# Altium project Backplane_REVA.PrjPcb (part 1 of 3)
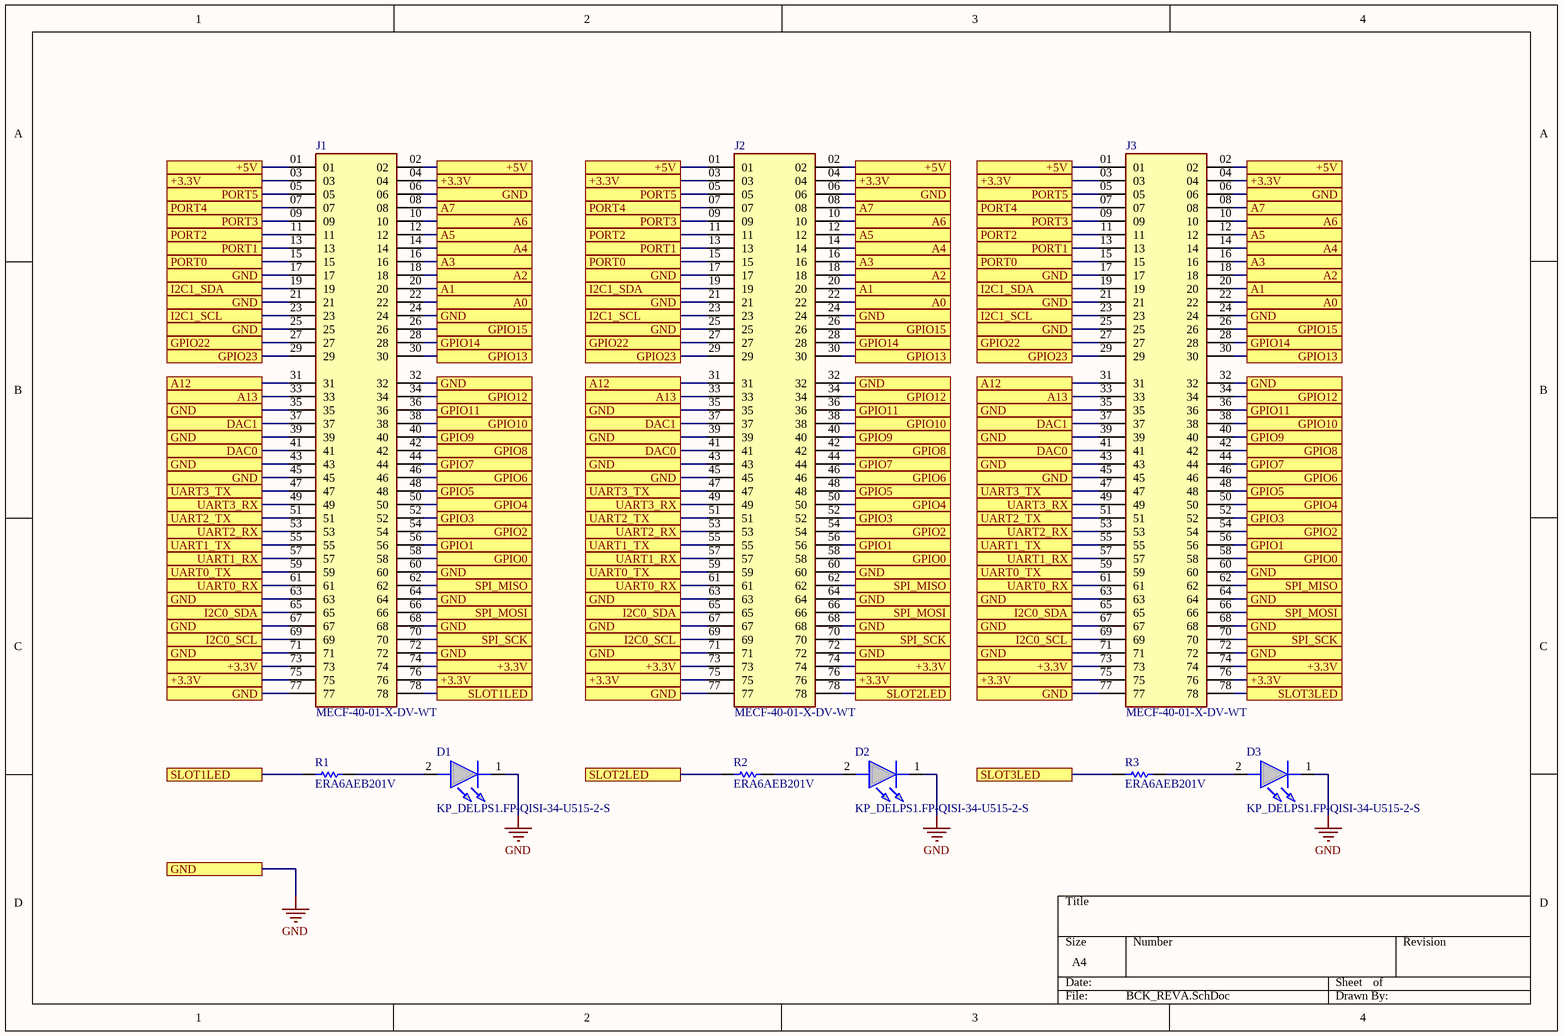
[diagram p0: BCK_REVA.SchDoc]
3 sheets, 27 parts. Net scope: flat (ports and power ports of the same name join across sheets).
Board file: BCK_REVA.PcbDoc
Sheets:
  BCK_REVA.SchDoc
  BCK_REVA_2.SchDoc
  BCK_REVA_3.SchDoc

## Sheet BCK_REVA.SchDoc
size A4; SheetNumber: 1; SheetTotal: 3

### Parts
D1  KP_DELPS1.FP-QISI-34-U515-2-S  [KPDELPS1FPQISI34U5152S]
D2  KP_DELPS1.FP-QISI-34-U515-2-S  [KPDELPS1FPQISI34U5152S]
D3  KP_DELPS1.FP-QISI-34-U515-2-S  [KPDELPS1FPQISI34U5152S]
J1  MECF-40-01-X-DV-WT  [SAMTEC_MECF-40-01-X-DV-WT]
J2  MECF-40-01-X-DV-WT  [SAMTEC_MECF-40-01-X-DV-WT]
J3  MECF-40-01-X-DV-WT  [SAMTEC_MECF-40-01-X-DV-WT]
R1  ERA6AEB201V  [RESC2013X60X40NL20T25]
R2  ERA6AEB201V  [RESC2013X60X40NL20T25]
R3  ERA6AEB201V  [RESC2013X60X40NL20T25]

### Ports
+3.3V (see BCK_REVA[1A], BCK_REVA[1C], BCK_REVA[2A], BCK_REVA[2C], BCK_REVA[3A], BCK_REVA[3C], BCK_REVA[4A], BCK_REVA[4C], BCK_REVA_2[1A], BCK_REVA_2[1C], BCK_REVA_2[2A], BCK_REVA_2[2C], BCK_REVA_2[3A], BCK_REVA_2[3C], BCK_REVA_2[4A], BCK_REVA_2[4C], BCK_REVA_3[1A], BCK_REVA_3[1C], BCK_REVA_3[2A], BCK_REVA_3[2C], BCK_REVA_3[3A], BCK_REVA_3[3C], BCK_REVA_3[4A], BCK_REVA_3[4C]), +3.3V (see BCK_REVA[1A], BCK_REVA[1C], BCK_REVA[2A], BCK_REVA[2C], BCK_REVA[3A], BCK_REVA[3C], BCK_REVA[4C], BCK_REVA_2[1A], BCK_REVA_2[1C], BCK_REVA_2[2A], BCK_REVA_2[2C], BCK_REVA_2[3A], BCK_REVA_2[3C], BCK_REVA_2[4A], BCK_REVA_2[4C], BCK_REVA_3[1A], BCK_REVA_3[1C], BCK_REVA_3[2A], BCK_REVA_3[2C], BCK_REVA_3[3A], BCK_REVA_3[3C], BCK_REVA_3[4A], BCK_REVA_3[4C]), +3.3V (see BCK_REVA[1C], BCK_REVA[2A], BCK_REVA[2C], BCK_REVA[3A], BCK_REVA[3C], BCK_REVA[4A], BCK_REVA[4C], BCK_REVA_2[1A], BCK_REVA_2[1C], BCK_REVA_2[2A], BCK_REVA_2[2C], BCK_REVA_2[3A], BCK_REVA_2[3C], BCK_REVA_2[4A], BCK_REVA_2[4C], BCK_REVA_3[1A], BCK_REVA_3[1C], BCK_REVA_3[2A], BCK_REVA_3[2C], BCK_REVA_3[3A], BCK_REVA_3[3C], BCK_REVA_3[4A], BCK_REVA_3[4C]), +5V (see BCK_REVA[1A], BCK_REVA[2A], BCK_REVA[3A], BCK_REVA[4A], BCK_REVA_2[1A], BCK_REVA_2[2A], BCK_REVA_2[3A], BCK_REVA_2[4A], BCK_REVA_3[1A], BCK_REVA_3[2A], BCK_REVA_3[3A], BCK_REVA_3[4A]), +5V (see BCK_REVA[1A], BCK_REVA[2A], BCK_REVA[3A], BCK_REVA_2[1A], BCK_REVA_2[2A], BCK_REVA_2[3A], BCK_REVA_2[4A], BCK_REVA_3[1A], BCK_REVA_3[2A], BCK_REVA_3[3A], BCK_REVA_3[4A]), +5V (see BCK_REVA[2A], BCK_REVA[3A], BCK_REVA[4A], BCK_REVA_2[1A], BCK_REVA_2[2A], BCK_REVA_2[3A], BCK_REVA_2[4A], BCK_REVA_3[1A], BCK_REVA_3[2A], BCK_REVA_3[3A], BCK_REVA_3[4A]), A0 (see BCK_REVA[2B], BCK_REVA[3B], BCK_REVA_2[2B], BCK_REVA_2[3B], BCK_REVA_2[4B], BCK_REVA_3[2B], BCK_REVA_3[3B], BCK_REVA_3[4B]), A0 (see BCK_REVA[2B], BCK_REVA[4B], BCK_REVA_2[2B], BCK_REVA_2[3B], BCK_REVA_2[4B], BCK_REVA_3[2B], BCK_REVA_3[3B], BCK_REVA_3[4B]), A0 (see BCK_REVA[3B], BCK_REVA[4B], BCK_REVA_2[2B], BCK_REVA_2[3B], BCK_REVA_2[4B], BCK_REVA_3[2B], BCK_REVA_3[3B], BCK_REVA_3[4B]), A1 (see BCK_REVA[2B], BCK_REVA[3B], BCK_REVA_2[2B], BCK_REVA_2[3B], BCK_REVA_2[4B], BCK_REVA_3[2B], BCK_REVA_3[3B], BCK_REVA_3[4B]), A1 (see BCK_REVA[2B], BCK_REVA[4B], BCK_REVA_2[2B], BCK_REVA_2[3B], BCK_REVA_2[4B], BCK_REVA_3[2B], BCK_REVA_3[3B], BCK_REVA_3[4B]), A1 (see BCK_REVA[3B], BCK_REVA[4B], BCK_REVA_2[2B], BCK_REVA_2[3B], BCK_REVA_2[4B], BCK_REVA_3[2B], BCK_REVA_3[3B], BCK_REVA_3[4B]), A2 (see BCK_REVA[2B], BCK_REVA[3B], BCK_REVA_2[2B], BCK_REVA_2[3B], BCK_REVA_2[4B], BCK_REVA_3[2B], BCK_REVA_3[3B], BCK_REVA_3[4B]), A2 (see BCK_REVA[2B], BCK_REVA[4B], BCK_REVA_2[2B], BCK_REVA_2[3B], BCK_REVA_2[4B], BCK_REVA_3[2B], BCK_REVA_3[3B], BCK_REVA_3[4B]), A2 (see BCK_REVA[3B], BCK_REVA[4B], BCK_REVA_2[2B], BCK_REVA_2[3B], BCK_REVA_2[4B], BCK_REVA_3[2B], BCK_REVA_3[3B], BCK_REVA_3[4B]), A3 (see BCK_REVA[2B], BCK_REVA[3B], BCK_REVA_2[2B], BCK_REVA_2[3B], BCK_REVA_2[4B], BCK_REVA_3[2B], BCK_REVA_3[3B], BCK_REVA_3[4B]), A3 (see BCK_REVA[2B], BCK_REVA[4B], BCK_REVA_2[2B], BCK_REVA_2[3B], BCK_REVA_2[4B], BCK_REVA_3[2B], BCK_REVA_3[3B], BCK_REVA_3[4B]), A3 (see BCK_REVA[3B], BCK_REVA[4B], BCK_REVA_2[2B], BCK_REVA_2[3B], BCK_REVA_2[4B], BCK_REVA_3[2B], BCK_REVA_3[3B], BCK_REVA_3[4B]), A4 (see BCK_REVA[2A], BCK_REVA[3A], BCK_REVA_2[2A], BCK_REVA_2[3A], BCK_REVA_2[4A], BCK_REVA_3[2A], BCK_REVA_3[3A], BCK_REVA_3[4A]), A4 (see BCK_REVA[2A], BCK_REVA[4A], BCK_REVA_2[2A], BCK_REVA_2[3A], BCK_REVA_2[4A], BCK_REVA_3[2A], BCK_REVA_3[3A], BCK_REVA_3[4A]), A4 (see BCK_REVA[3A], BCK_REVA[4A], BCK_REVA_2[2A], BCK_REVA_2[3A], BCK_REVA_2[4A], BCK_REVA_3[2A], BCK_REVA_3[3A], BCK_REVA_3[4A]), A5 (see BCK_REVA[2A], BCK_REVA[3A], BCK_REVA_2[2A], BCK_REVA_2[3A], BCK_REVA_2[4A], BCK_REVA_3[2A], BCK_REVA_3[3A], BCK_REVA_3[4A]), A5 (see BCK_REVA[2A], BCK_REVA[4A], BCK_REVA_2[2A], BCK_REVA_2[3A], BCK_REVA_2[4A], BCK_REVA_3[2A], BCK_REVA_3[3A], BCK_REVA_3[4A]), A5 (see BCK_REVA[3A], BCK_REVA[4A], BCK_REVA_2[2A], BCK_REVA_2[3A], BCK_REVA_2[4A], BCK_REVA_3[2A], BCK_REVA_3[3A], BCK_REVA_3[4A]), A6 (see BCK_REVA[2A], BCK_REVA[3A], BCK_REVA_2[2A], BCK_REVA_2[3A], BCK_REVA_2[4A], BCK_REVA_3[2A], BCK_REVA_3[3A], BCK_REVA_3[4A]), A6 (see BCK_REVA[2A], BCK_REVA[4A], BCK_REVA_2[2A], BCK_REVA_2[3A], BCK_REVA_2[4A], BCK_REVA_3[2A], BCK_REVA_3[3A], BCK_REVA_3[4A]), A6 (see BCK_REVA[3A], BCK_REVA[4A], BCK_REVA_2[2A], BCK_REVA_2[3A], BCK_REVA_2[4A], BCK_REVA_3[2A], BCK_REVA_3[3A], BCK_REVA_3[4A]), A7 (see BCK_REVA[2A], BCK_REVA[3A], BCK_REVA_2[2A], BCK_REVA_2[3A], BCK_REVA_2[4A], BCK_REVA_3[2A], BCK_REVA_3[3A], BCK_REVA_3[4A]), A7 (see BCK_REVA[2A], BCK_REVA[4A], BCK_REVA_2[2A], BCK_REVA_2[3A], BCK_REVA_2[4A], BCK_REVA_3[2A], BCK_REVA_3[3A], BCK_REVA_3[4A]), A7 (see BCK_REVA[3A], BCK_REVA[4A], BCK_REVA_2[2A], BCK_REVA_2[3A], BCK_REVA_2[4A], BCK_REVA_3[2A], BCK_REVA_3[3A], BCK_REVA_3[4A]), A12 (see BCK_REVA[1B], BCK_REVA[2B], BCK_REVA_2[1B], BCK_REVA_2[2B], BCK_REVA_2[3B], BCK_REVA_3[1B], BCK_REVA_3[2B], BCK_REVA_3[3B]), A12 (see BCK_REVA[1B], BCK_REVA[3B], BCK_REVA_2[1B], BCK_REVA_2[2B], BCK_REVA_2[3B], BCK_REVA_3[1B], BCK_REVA_3[2B], BCK_REVA_3[3B]), A12 (see BCK_REVA[2B], BCK_REVA[3B], BCK_REVA_2[1B], BCK_REVA_2[2B], BCK_REVA_2[3B], BCK_REVA_3[1B], BCK_REVA_3[2B], BCK_REVA_3[3B]), A13 (see BCK_REVA[1B], BCK_REVA[2B], BCK_REVA_2[1B], BCK_REVA_2[2B], BCK_REVA_2[3B], BCK_REVA_3[1B], BCK_REVA_3[2B], BCK_REVA_3[3B]), A13 (see BCK_REVA[1B], BCK_REVA[3B], BCK_REVA_2[1B], BCK_REVA_2[2B], BCK_REVA_2[3B], BCK_REVA_3[1B], BCK_REVA_3[2B], BCK_REVA_3[3B]), A13 (see BCK_REVA[2B], BCK_REVA[3B], BCK_REVA_2[1B], BCK_REVA_2[2B], BCK_REVA_2[3B], BCK_REVA_3[1B], BCK_REVA_3[2B], BCK_REVA_3[3B]), DAC0 (see BCK_REVA[1B], BCK_REVA[2B], BCK_REVA_2[1B], BCK_REVA_2[2B], BCK_REVA_2[3B], BCK_REVA_3[1B], BCK_REVA_3[2B], BCK_REVA_3[3B]), DAC0 (see BCK_REVA[1B], BCK_REVA[3B], BCK_REVA_2[1B], BCK_REVA_2[2B], BCK_REVA_2[3B], BCK_REVA_3[1B], BCK_REVA_3[2B], BCK_REVA_3[3B]), DAC0 (see BCK_REVA[2B], BCK_REVA[3B], BCK_REVA_2[1B], BCK_REVA_2[2B], BCK_REVA_2[3B], BCK_REVA_3[1B], BCK_REVA_3[2B], BCK_REVA_3[3B]), DAC1 (see BCK_REVA[1B], BCK_REVA[2B], BCK_REVA_2[1B], BCK_REVA_2[2B], BCK_REVA_2[3B], BCK_REVA_3[1B], BCK_REVA_3[2B], BCK_REVA_3[3B]), DAC1 (see BCK_REVA[1B], BCK_REVA[3B], BCK_REVA_2[1B], BCK_REVA_2[2B], BCK_REVA_2[3B], BCK_REVA_3[1B], BCK_REVA_3[2B], BCK_REVA_3[3B]), DAC1 (see BCK_REVA[2B], BCK_REVA[3B], BCK_REVA_2[1B], BCK_REVA_2[2B], BCK_REVA_2[3B], BCK_REVA_3[1B], BCK_REVA_3[2B], BCK_REVA_3[3B]), GND (see BCK_REVA[1B], BCK_REVA[1C], BCK_REVA[1D], BCK_REVA[2A], BCK_REVA[2B], BCK_REVA[2C], BCK_REVA[3A], BCK_REVA[3B], BCK_REVA[3C], BCK_REVA[4A], BCK_REVA[4B], BCK_REVA[4C], BCK_REVA_2[1B], BCK_REVA_2[1C], BCK_REVA_2[2A], BCK_REVA_2[2B], BCK_REVA_2[2C], BCK_REVA_2[3A], BCK_REVA_2[3B], BCK_REVA_2[3C], BCK_REVA_2[4A], BCK_REVA_2[4B], BCK_REVA_2[4C], BCK_REVA_3[1B], BCK_REVA_3[1C], BCK_REVA_3[2A], BCK_REVA_3[2B], BCK_REVA_3[2C], BCK_REVA_3[3A], BCK_REVA_3[3B], BCK_REVA_3[3C], BCK_REVA_3[4A], BCK_REVA_3[4B], BCK_REVA_3[4C]), GND (see BCK_REVA[1B], BCK_REVA[1C], BCK_REVA[1D], BCK_REVA[2A], BCK_REVA[2B], BCK_REVA[2C], BCK_REVA[3A], BCK_REVA[3B], BCK_REVA[3C], BCK_REVA[4B], BCK_REVA[4C], BCK_REVA_2[1B], BCK_REVA_2[1C], BCK_REVA_2[2A], BCK_REVA_2[2B], BCK_REVA_2[2C], BCK_REVA_2[3A], BCK_REVA_2[3B], BCK_REVA_2[3C], BCK_REVA_2[4A], BCK_REVA_2[4B], BCK_REVA_2[4C], BCK_REVA_3[1B], BCK_REVA_3[1C], BCK_REVA_3[2A], BCK_REVA_3[2B], BCK_REVA_3[2C], BCK_REVA_3[3A], BCK_REVA_3[3B], BCK_REVA_3[3C], BCK_REVA_3[4A], BCK_REVA_3[4B], BCK_REVA_3[4C]), GND (see BCK_REVA[1B], BCK_REVA[1C], BCK_REVA[1D], BCK_REVA[2A], BCK_REVA[2B], BCK_REVA[2C], BCK_REVA[3B], BCK_REVA[3C], BCK_REVA[4A], BCK_REVA[4B], BCK_REVA[4C], BCK_REVA_2[1B], BCK_REVA_2[1C], BCK_REVA_2[2A], BCK_REVA_2[2B], BCK_REVA_2[2C], BCK_REVA_2[3A], BCK_REVA_2[3B], BCK_REVA_2[3C], BCK_REVA_2[4A], BCK_REVA_2[4B], BCK_REVA_2[4C], BCK_REVA_3[1B], BCK_REVA_3[1C], BCK_REVA_3[2A], BCK_REVA_3[2B], BCK_REVA_3[2C], BCK_REVA_3[3A], BCK_REVA_3[3B], BCK_REVA_3[3C], BCK_REVA_3[4A], BCK_REVA_3[4B], BCK_REVA_3[4C]), GND (see BCK_REVA[1B], BCK_REVA[1C], BCK_REVA[1D], BCK_REVA[2B], BCK_REVA[2C], BCK_REVA[3A], BCK_REVA[3B], BCK_REVA[3C], BCK_REVA[4A], BCK_REVA[4B], BCK_REVA[4C], BCK_REVA_2[1B], BCK_REVA_2[1C], BCK_REVA_2[2A], BCK_REVA_2[2B], BCK_REVA_2[2C], BCK_REVA_2[3A], BCK_REVA_2[3B], BCK_REVA_2[3C], BCK_REVA_2[4A], BCK_REVA_2[4B], BCK_REVA_2[4C], BCK_REVA_3[1B], BCK_REVA_3[1C], BCK_REVA_3[2A], BCK_REVA_3[2B], BCK_REVA_3[2C], BCK_REVA_3[3A], BCK_REVA_3[3B], BCK_REVA_3[3C], BCK_REVA_3[4A], BCK_REVA_3[4B], BCK_REVA_3[4C]), GND (see BCK_REVA[1B], BCK_REVA[1C], BCK_REVA[2A], BCK_REVA[2B], BCK_REVA[2C], BCK_REVA[3A], BCK_REVA[3B], BCK_REVA[3C], BCK_REVA[4A], BCK_REVA[4B], BCK_REVA[4C], BCK_REVA_2[1B], BCK_REVA_2[1C], BCK_REVA_2[2A], BCK_REVA_2[2B], BCK_REVA_2[2C], BCK_REVA_2[3A], BCK_REVA_2[3B], BCK_REVA_2[3C], BCK_REVA_2[4A], BCK_REVA_2[4B], BCK_REVA_2[4C], BCK_REVA_3[1B], BCK_REVA_3[1C], BCK_REVA_3[2A], BCK_REVA_3[2B], BCK_REVA_3[2C], BCK_REVA_3[3A], BCK_REVA_3[3B], BCK_REVA_3[3C], BCK_REVA_3[4A], BCK_REVA_3[4B], BCK_REVA_3[4C]), GPIO0 (see BCK_REVA[2C], BCK_REVA[3C], BCK_REVA_2[2C], BCK_REVA_2[3C], BCK_REVA_2[4C], BCK_REVA_3[2C], BCK_REVA_3[3C], BCK_REVA_3[4C]), GPIO0 (see BCK_REVA[2C], BCK_REVA[4C], BCK_REVA_2[2C], BCK_REVA_2[3C], BCK_REVA_2[4C], BCK_REVA_3[2C], BCK_REVA_3[3C], BCK_REVA_3[4C]), GPIO0 (see BCK_REVA[3C], BCK_REVA[4C], BCK_REVA_2[2C], BCK_REVA_2[3C], BCK_REVA_2[4C], BCK_REVA_3[2C], BCK_REVA_3[3C], BCK_REVA_3[4C]), GPIO1 (see BCK_REVA[2C], BCK_REVA[3C], BCK_REVA_2[2C], BCK_REVA_2[3C], BCK_REVA_2[4C], BCK_REVA_3[2C], BCK_REVA_3[3C], BCK_REVA_3[4C]), GPIO1 (see BCK_REVA[2C], BCK_REVA[4C], BCK_REVA_2[2C], BCK_REVA_2[3C], BCK_REVA_2[4C], BCK_REVA_3[2C], BCK_REVA_3[3C], BCK_REVA_3[4C]), GPIO1 (see BCK_REVA[3C], BCK_REVA[4C], BCK_REVA_2[2C], BCK_REVA_2[3C], BCK_REVA_2[4C], BCK_REVA_3[2C], BCK_REVA_3[3C], BCK_REVA_3[4C]), GPIO2 (see BCK_REVA[2C], BCK_REVA[3C], BCK_REVA_2[2C], BCK_REVA_2[3C], BCK_REVA_2[4C], BCK_REVA_3[2C], BCK_REVA_3[3C], BCK_REVA_3[4C]), GPIO2 (see BCK_REVA[2C], BCK_REVA[4C], BCK_REVA_2[2C], BCK_REVA_2[3C], BCK_REVA_2[4C], BCK_REVA_3[2C], BCK_REVA_3[3C], BCK_REVA_3[4C]), GPIO2 (see BCK_REVA[3C], BCK_REVA[4C], BCK_REVA_2[2C], BCK_REVA_2[3C], BCK_REVA_2[4C], BCK_REVA_3[2C], BCK_REVA_3[3C], BCK_REVA_3[4C]), GPIO3 (see BCK_REVA[2C], BCK_REVA[3C], BCK_REVA_2[2C], BCK_REVA_2[3C], BCK_REVA_2[4C], BCK_REVA_3[2C], BCK_REVA_3[3C], BCK_REVA_3[4C]), GPIO3 (see BCK_REVA[2C], BCK_REVA[4C], BCK_REVA_2[2C], BCK_REVA_2[3C], BCK_REVA_2[4C], BCK_REVA_3[2C], BCK_REVA_3[3C], BCK_REVA_3[4C]), GPIO3 (see BCK_REVA[3C], BCK_REVA[4C], BCK_REVA_2[2C], BCK_REVA_2[3C], BCK_REVA_2[4C], BCK_REVA_3[2C], BCK_REVA_3[3C], BCK_REVA_3[4C]), GPIO4 (see BCK_REVA[2B], BCK_REVA[3B], BCK_REVA_2[2B], BCK_REVA_2[3B], BCK_REVA_2[4B], BCK_REVA_3[2B], BCK_REVA_3[3B], BCK_REVA_3[4B]), GPIO4 (see BCK_REVA[2B], BCK_REVA[4B], BCK_REVA_2[2B], BCK_REVA_2[3B], BCK_REVA_2[4B], BCK_REVA_3[2B], BCK_REVA_3[3B], BCK_REVA_3[4B]), GPIO4 (see BCK_REVA[3B], BCK_REVA[4B], BCK_REVA_2[2B], BCK_REVA_2[3B], BCK_REVA_2[4B], BCK_REVA_3[2B], BCK_REVA_3[3B], BCK_REVA_3[4B]), GPIO5 (see BCK_REVA[2B], BCK_REVA[3B], BCK_REVA_2[2B], BCK_REVA_2[3B], BCK_REVA_2[4B], BCK_REVA_3[2B], BCK_REVA_3[3B], BCK_REVA_3[4B]), GPIO5 (see BCK_REVA[2B], BCK_REVA[4B], BCK_REVA_2[2B], BCK_REVA_2[3B], BCK_REVA_2[4B], BCK_REVA_3[2B], BCK_REVA_3[3B], BCK_REVA_3[4B]), GPIO5 (see BCK_REVA[3B], BCK_REVA[4B], BCK_REVA_2[2B], BCK_REVA_2[3B], BCK_REVA_2[4B], BCK_REVA_3[2B], BCK_REVA_3[3B], BCK_REVA_3[4B]), GPIO6 (see BCK_REVA[2B], BCK_REVA[3B], BCK_REVA_2[2B], BCK_REVA_2[3B], BCK_REVA_2[4B], BCK_REVA_3[2B], BCK_REVA_3[3B], BCK_REVA_3[4B]), GPIO6 (see BCK_REVA[2B], BCK_REVA[4B], BCK_REVA_2[2B], BCK_REVA_2[3B], BCK_REVA_2[4B], BCK_REVA_3[2B], BCK_REVA_3[3B], BCK_REVA_3[4B]), GPIO6 (see BCK_REVA[3B], BCK_REVA[4B], BCK_REVA_2[2B], BCK_REVA_2[3B], BCK_REVA_2[4B], BCK_REVA_3[2B], BCK_REVA_3[3B], BCK_REVA_3[4B]), GPIO7 (see BCK_REVA[2B], BCK_REVA[3B], BCK_REVA_2[2B], BCK_REVA_2[3B], BCK_REVA_2[4B], BCK_REVA_3[2B], BCK_REVA_3[3B], BCK_REVA_3[4B]), GPIO7 (see BCK_REVA[2B], BCK_REVA[4B], BCK_REVA_2[2B], BCK_REVA_2[3B], BCK_REVA_2[4B], BCK_REVA_3[2B], BCK_REVA_3[3B], BCK_REVA_3[4B]), GPIO7 (see BCK_REVA[3B], BCK_REVA[4B], BCK_REVA_2[2B], BCK_REVA_2[3B], BCK_REVA_2[4B], BCK_REVA_3[2B], BCK_REVA_3[3B], BCK_REVA_3[4B]), GPIO8 (see BCK_REVA[2B], BCK_REVA[3B], BCK_REVA_2[2B], BCK_REVA_2[3B], BCK_REVA_2[4B], BCK_REVA_3[2B], BCK_REVA_3[3B], BCK_REVA_3[4B]), GPIO8 (see BCK_REVA[2B], BCK_REVA[4B], BCK_REVA_2[2B], BCK_REVA_2[3B], BCK_REVA_2[4B], BCK_REVA_3[2B], BCK_REVA_3[3B], BCK_REVA_3[4B]), GPIO8 (see BCK_REVA[3B], BCK_REVA[4B], BCK_REVA_2[2B], BCK_REVA_2[3B], BCK_REVA_2[4B], BCK_REVA_3[2B], BCK_REVA_3[3B], BCK_REVA_3[4B]), GPIO9 (see BCK_REVA[2B], BCK_REVA[3B], BCK_REVA_2[2B], BCK_REVA_2[3B], BCK_REVA_2[4B], BCK_REVA_3[2B], BCK_REVA_3[3B], BCK_REVA_3[4B]), GPIO9 (see BCK_REVA[2B], BCK_REVA[4B], BCK_REVA_2[2B], BCK_REVA_2[3B], BCK_REVA_2[4B], BCK_REVA_3[2B], BCK_REVA_3[3B], BCK_REVA_3[4B]), GPIO9 (see BCK_REVA[3B], BCK_REVA[4B], BCK_REVA_2[2B], BCK_REVA_2[3B], BCK_REVA_2[4B], BCK_REVA_3[2B], BCK_REVA_3[3B], BCK_REVA_3[4B]), GPIO10 (see BCK_REVA[2B], BCK_REVA[3B], BCK_REVA_2[2B], BCK_REVA_2[3B], BCK_REVA_2[4B], BCK_REVA_3[2B], BCK_REVA_3[3B], BCK_REVA_3[4B]), GPIO10 (see BCK_REVA[2B], BCK_REVA[4B], BCK_REVA_2[2B], BCK_REVA_2[3B], BCK_REVA_2[4B], BCK_REVA_3[2B], BCK_REVA_3[3B], BCK_REVA_3[4B]), GPIO10 (see BCK_REVA[3B], BCK_REVA[4B], BCK_REVA_2[2B], BCK_REVA_2[3B], BCK_REVA_2[4B], BCK_REVA_3[2B], BCK_REVA_3[3B], BCK_REVA_3[4B]), GPIO11 (see BCK_REVA[2B], BCK_REVA[3B], BCK_REVA_2[2B], BCK_REVA_2[3B], BCK_REVA_2[4B], BCK_REVA_3[2B], BCK_REVA_3[3B], BCK_REVA_3[4B]), GPIO11 (see BCK_REVA[2B], BCK_REVA[4B], BCK_REVA_2[2B], BCK_REVA_2[3B], BCK_REVA_2[4B], BCK_REVA_3[2B], BCK_REVA_3[3B], BCK_REVA_3[4B]), GPIO11 (see BCK_REVA[3B], BCK_REVA[4B], BCK_REVA_2[2B], BCK_REVA_2[3B], BCK_REVA_2[4B], BCK_REVA_3[2B], BCK_REVA_3[3B], BCK_REVA_3[4B]), GPIO12 (see BCK_REVA[2B], BCK_REVA[3B], BCK_REVA_2[2B], BCK_REVA_2[3B], BCK_REVA_2[4B], BCK_REVA_3[2B], BCK_REVA_3[3B], BCK_REVA_3[4B]), GPIO12 (see BCK_REVA[2B], BCK_REVA[4B], BCK_REVA_2[2B], BCK_REVA_2[3B], BCK_REVA_2[4B], BCK_REVA_3[2B], BCK_REVA_3[3B], BCK_REVA_3[4B]), GPIO12 (see BCK_REVA[3B], BCK_REVA[4B], BCK_REVA_2[2B], BCK_REVA_2[3B], BCK_REVA_2[4B], BCK_REVA_3[2B], BCK_REVA_3[3B], BCK_REVA_3[4B]), GPIO13 (see BCK_REVA[2B], BCK_REVA[3B], BCK_REVA_2[2B], BCK_REVA_2[3B], BCK_REVA_2[4B], BCK_REVA_3[2B], BCK_REVA_3[3B], BCK_REVA_3[4B]), GPIO13 (see BCK_REVA[2B], BCK_REVA[4B], BCK_REVA_2[2B], BCK_REVA_2[3B], BCK_REVA_2[4B], BCK_REVA_3[2B], BCK_REVA_3[3B], BCK_REVA_3[4B]), GPIO13 (see BCK_REVA[3B], BCK_REVA[4B], BCK_REVA_2[2B], BCK_REVA_2[3B], BCK_REVA_2[4B], BCK_REVA_3[2B], BCK_REVA_3[3B], BCK_REVA_3[4B]), GPIO14 (see BCK_REVA[2B], BCK_REVA[3B], BCK_REVA_2[2B], BCK_REVA_2[3B], BCK_REVA_2[4B], BCK_REVA_3[2B], BCK_REVA_3[3B], BCK_REVA_3[4B]), GPIO14 (see BCK_REVA[2B], BCK_REVA[4B], BCK_REVA_2[2B], BCK_REVA_2[3B], BCK_REVA_2[4B], BCK_REVA_3[2B], BCK_REVA_3[3B], BCK_REVA_3[4B]), GPIO14 (see BCK_REVA[3B], BCK_REVA[4B], BCK_REVA_2[2B], BCK_REVA_2[3B], BCK_REVA_2[4B], BCK_REVA_3[2B], BCK_REVA_3[3B], BCK_REVA_3[4B]), GPIO15 (see BCK_REVA[2B], BCK_REVA[3B], BCK_REVA_2[2B], BCK_REVA_2[3B], BCK_REVA_2[4B], BCK_REVA_3[2B], BCK_REVA_3[3B], BCK_REVA_3[4B]), GPIO15 (see BCK_REVA[2B], BCK_REVA[4B], BCK_REVA_2[2B], BCK_REVA_2[3B], BCK_REVA_2[4B], BCK_REVA_3[2B], BCK_REVA_3[3B], BCK_REVA_3[4B]), GPIO15 (see BCK_REVA[3B], BCK_REVA[4B], BCK_REVA_2[2B], BCK_REVA_2[3B], BCK_REVA_2[4B], BCK_REVA_3[2B], BCK_REVA_3[3B], BCK_REVA_3[4B]), GPIO22 (see BCK_REVA[1B], BCK_REVA[2B], BCK_REVA_2[1B], BCK_REVA_2[2B], BCK_REVA_2[3B], BCK_REVA_3[1B], BCK_REVA_3[2B], BCK_REVA_3[3B]), GPIO22 (see BCK_REVA[1B], BCK_REVA[3B], BCK_REVA_2[1B], BCK_REVA_2[2B], BCK_REVA_2[3B], BCK_REVA_3[1B], BCK_REVA_3[2B], BCK_REVA_3[3B]), GPIO22 (see BCK_REVA[2B], BCK_REVA[3B], BCK_REVA_2[1B], BCK_REVA_2[2B], BCK_REVA_2[3B], BCK_REVA_3[1B], BCK_REVA_3[2B], BCK_REVA_3[3B]), GPIO23 (see BCK_REVA[1B], BCK_REVA[2B], BCK_REVA_2[1B], BCK_REVA_2[2B], BCK_REVA_2[3B], BCK_REVA_3[1B], BCK_REVA_3[2B], BCK_REVA_3[3B]), GPIO23 (see BCK_REVA[1B], BCK_REVA[3B], BCK_REVA_2[1B], BCK_REVA_2[2B], BCK_REVA_2[3B], BCK_REVA_3[1B], BCK_REVA_3[2B], BCK_REVA_3[3B]), GPIO23 (see BCK_REVA[2B], BCK_REVA[3B], BCK_REVA_2[1B], BCK_REVA_2[2B], BCK_REVA_2[3B], BCK_REVA_3[1B], BCK_REVA_3[2B], BCK_REVA_3[3B]), I2C0_SCL (see BCK_REVA[1C], BCK_REVA[2C], BCK_REVA_2[1C], BCK_REVA_2[2C], BCK_REVA_2[3C], BCK_REVA_3[1C], BCK_REVA_3[2C], BCK_REVA_3[3C]), I2C0_SCL (see BCK_REVA[1C], BCK_REVA[3C], BCK_REVA_2[1C], BCK_REVA_2[2C], BCK_REVA_2[3C], BCK_REVA_3[1C], BCK_REVA_3[2C], BCK_REVA_3[3C]), I2C0_SCL (see BCK_REVA[2C], BCK_REVA[3C], BCK_REVA_2[1C], BCK_REVA_2[2C], BCK_REVA_2[3C], BCK_REVA_3[1C], BCK_REVA_3[2C], BCK_REVA_3[3C]), I2C0_SDA (see BCK_REVA[1C], BCK_REVA[2C], BCK_REVA_2[1C], BCK_REVA_2[2C], BCK_REVA_2[3C], BCK_REVA_3[1C], BCK_REVA_3[2C], BCK_REVA_3[3C]), I2C0_SDA (see BCK_REVA[1C], BCK_REVA[3C], BCK_REVA_2[1C], BCK_REVA_2[2C], BCK_REVA_2[3C], BCK_REVA_3[1C], BCK_REVA_3[2C], BCK_REVA_3[3C]), I2C0_SDA (see BCK_REVA[2C], BCK_REVA[3C], BCK_REVA_2[1C], BCK_REVA_2[2C], BCK_REVA_2[3C], BCK_REVA_3[1C], BCK_REVA_3[2C], BCK_REVA_3[3C]), I2C1_SCL (see BCK_REVA[1B], BCK_REVA[2B], BCK_REVA_2[1B], BCK_REVA_2[2B], BCK_REVA_2[3B], BCK_REVA_3[1B], BCK_REVA_3[2B], BCK_REVA_3[3B]), I2C1_SCL (see BCK_REVA[1B], BCK_REVA[3B], BCK_REVA_2[1B], BCK_REVA_2[2B], BCK_REVA_2[3B], BCK_REVA_3[1B], BCK_REVA_3[2B], BCK_REVA_3[3B]), I2C1_SCL (see BCK_REVA[2B], BCK_REVA[3B], BCK_REVA_2[1B], BCK_REVA_2[2B], BCK_REVA_2[3B], BCK_REVA_3[1B], BCK_REVA_3[2B], BCK_REVA_3[3B]), I2C1_SDA (see BCK_REVA[1B], BCK_REVA[2B], BCK_REVA_2[1B], BCK_REVA_2[2B], BCK_REVA_2[3B], BCK_REVA_3[1B], BCK_REVA_3[2B], BCK_REVA_3[3B]), I2C1_SDA (see BCK_REVA[1B], BCK_REVA[3B], BCK_REVA_2[1B], BCK_REVA_2[2B], BCK_REVA_2[3B], BCK_REVA_3[1B], BCK_REVA_3[2B], BCK_REVA_3[3B]), I2C1_SDA (see BCK_REVA[2B], BCK_REVA[3B], BCK_REVA_2[1B], BCK_REVA_2[2B], BCK_REVA_2[3B], BCK_REVA_3[1B], BCK_REVA_3[2B], BCK_REVA_3[3B]), PORT0 (see BCK_REVA[1B], BCK_REVA[2B], BCK_REVA_2[1B], BCK_REVA_2[2B], BCK_REVA_2[3B], BCK_REVA_3[1B], BCK_REVA_3[2B], BCK_REVA_3[3B]), PORT0 (see BCK_REVA[1B], BCK_REVA[3B], BCK_REVA_2[1B], BCK_REVA_2[2B], BCK_REVA_2[3B], BCK_REVA_3[1B], BCK_REVA_3[2B], BCK_REVA_3[3B]), PORT0 (see BCK_REVA[2B], BCK_REVA[3B], BCK_REVA_2[1B], BCK_REVA_2[2B], BCK_REVA_2[3B], BCK_REVA_3[1B], BCK_REVA_3[2B], BCK_REVA_3[3B]), PORT1 (see BCK_REVA[1A], BCK_REVA[2A], BCK_REVA_2[1A], BCK_REVA_2[2A], BCK_REVA_2[3A], BCK_REVA_3[1A], BCK_REVA_3[2A], BCK_REVA_3[3A]), PORT1 (see BCK_REVA[1A], BCK_REVA[3A], BCK_REVA_2[1A], BCK_REVA_2[2A], BCK_REVA_2[3A], BCK_REVA_3[1A], BCK_REVA_3[2A], BCK_REVA_3[3A]), PORT1 (see BCK_REVA[2A], BCK_REVA[3A], BCK_REVA_2[1A], BCK_REVA_2[2A], BCK_REVA_2[3A], BCK_REVA_3[1A], BCK_REVA_3[2A], BCK_REVA_3[3A]), PORT2 (see BCK_REVA[1A], BCK_REVA[2A], BCK_REVA_2[1A], BCK_REVA_2[2A], BCK_REVA_2[3A], BCK_REVA_3[1A], BCK_REVA_3[2A], BCK_REVA_3[3A]), PORT2 (see BCK_REVA[1A], BCK_REVA[3A], BCK_REVA_2[1A], BCK_REVA_2[2A], BCK_REVA_2[3A], BCK_REVA_3[1A], BCK_REVA_3[2A], BCK_REVA_3[3A]), PORT2 (see BCK_REVA[2A], BCK_REVA[3A], BCK_REVA_2[1A], BCK_REVA_2[2A], BCK_REVA_2[3A], BCK_REVA_3[1A], BCK_REVA_3[2A], BCK_REVA_3[3A]), PORT3 (see BCK_REVA[1A], BCK_REVA[2A], BCK_REVA_2[1A], BCK_REVA_2[2A], BCK_REVA_2[3A], BCK_REVA_3[1A], BCK_REVA_3[2A], BCK_REVA_3[3A]), PORT3 (see BCK_REVA[1A], BCK_REVA[3A], BCK_REVA_2[1A], BCK_REVA_2[2A], BCK_REVA_2[3A], BCK_REVA_3[1A], BCK_REVA_3[2A], BCK_REVA_3[3A]), PORT3 (see BCK_REVA[2A], BCK_REVA[3A], BCK_REVA_2[1A], BCK_REVA_2[2A], BCK_REVA_2[3A], BCK_REVA_3[1A], BCK_REVA_3[2A], BCK_REVA_3[3A]), PORT4 (see BCK_REVA[1A], BCK_REVA[2A], BCK_REVA_2[1A], BCK_REVA_2[2A], BCK_REVA_2[3A], BCK_REVA_3[1A], BCK_REVA_3[2A], BCK_REVA_3[3A]), PORT4 (see BCK_REVA[1A], BCK_REVA[3A], BCK_REVA_2[1A], BCK_REVA_2[2A], BCK_REVA_2[3A], BCK_REVA_3[1A], BCK_REVA_3[2A], BCK_REVA_3[3A]), PORT4 (see BCK_REVA[2A], BCK_REVA[3A], BCK_REVA_2[1A], BCK_REVA_2[2A], BCK_REVA_2[3A], BCK_REVA_3[1A], BCK_REVA_3[2A], BCK_REVA_3[3A]), PORT5 (see BCK_REVA[1A], BCK_REVA[2A], BCK_REVA_2[1A], BCK_REVA_2[2A], BCK_REVA_2[3A], BCK_REVA_3[1A], BCK_REVA_3[2A], BCK_REVA_3[3A]), PORT5 (see BCK_REVA[1A], BCK_REVA[3A], BCK_REVA_2[1A], BCK_REVA_2[2A], BCK_REVA_2[3A], BCK_REVA_3[1A], BCK_REVA_3[2A], BCK_REVA_3[3A]), PORT5 (see BCK_REVA[2A], BCK_REVA[3A], BCK_REVA_2[1A], BCK_REVA_2[2A], BCK_REVA_2[3A], BCK_REVA_3[1A], BCK_REVA_3[2A], BCK_REVA_3[3A]), SLOT1LED (see BCK_REVA[1D]), SLOT1LED (see BCK_REVA[2C]), SLOT2LED (see BCK_REVA[2D]), SLOT2LED (see BCK_REVA[3C]), SLOT3LED (see BCK_REVA[3D]), SLOT3LED (see BCK_REVA[4C]), SPI_MISO (see BCK_REVA[2C], BCK_REVA[3C], BCK_REVA_2[2C], BCK_REVA_2[3C], BCK_REVA_2[4C], BCK_REVA_3[2C], BCK_REVA_3[3C], BCK_REVA_3[4C]), SPI_MISO (see BCK_REVA[2C], BCK_REVA[4C], BCK_REVA_2[2C], BCK_REVA_2[3C], BCK_REVA_2[4C], BCK_REVA_3[2C], BCK_REVA_3[3C], BCK_REVA_3[4C]), SPI_MISO (see BCK_REVA[3C], BCK_REVA[4C], BCK_REVA_2[2C], BCK_REVA_2[3C], BCK_REVA_2[4C], BCK_REVA_3[2C], BCK_REVA_3[3C], BCK_REVA_3[4C]), SPI_MOSI (see BCK_REVA[2C], BCK_REVA[3C], BCK_REVA_2[2C], BCK_REVA_2[3C], BCK_REVA_2[4C], BCK_REVA_3[2C], BCK_REVA_3[3C], BCK_REVA_3[4C]), SPI_MOSI (see BCK_REVA[2C], BCK_REVA[4C], BCK_REVA_2[2C], BCK_REVA_2[3C], BCK_REVA_2[4C], BCK_REVA_3[2C], BCK_REVA_3[3C], BCK_REVA_3[4C]), SPI_MOSI (see BCK_REVA[3C], BCK_REVA[4C], BCK_REVA_2[2C], BCK_REVA_2[3C], BCK_REVA_2[4C], BCK_REVA_3[2C], BCK_REVA_3[3C], BCK_REVA_3[4C]), SPI_SCK (see BCK_REVA[2C], BCK_REVA[3C], BCK_REVA_2[2C], BCK_REVA_2[3C], BCK_REVA_2[4C], BCK_REVA_3[2C], BCK_REVA_3[3C], BCK_REVA_3[4C]), SPI_SCK (see BCK_REVA[2C], BCK_REVA[4C], BCK_REVA_2[2C], BCK_REVA_2[3C], BCK_REVA_2[4C], BCK_REVA_3[2C], BCK_REVA_3[3C], BCK_REVA_3[4C]), SPI_SCK (see BCK_REVA[3C], BCK_REVA[4C], BCK_REVA_2[2C], BCK_REVA_2[3C], BCK_REVA_2[4C], BCK_REVA_3[2C], BCK_REVA_3[3C], BCK_REVA_3[4C]), UART0_RX (see BCK_REVA[1C], BCK_REVA[2C], BCK_REVA_2[1C], BCK_REVA_2[2C], BCK_REVA_2[3C], BCK_REVA_3[1C], BCK_REVA_3[2C], BCK_REVA_3[3C]), UART0_RX (see BCK_REVA[1C], BCK_REVA[3C], BCK_REVA_2[1C], BCK_REVA_2[2C], BCK_REVA_2[3C], BCK_REVA_3[1C], BCK_REVA_3[2C], BCK_REVA_3[3C]), UART0_RX (see BCK_REVA[2C], BCK_REVA[3C], BCK_REVA_2[1C], BCK_REVA_2[2C], BCK_REVA_2[3C], BCK_REVA_3[1C], BCK_REVA_3[2C], BCK_REVA_3[3C]), UART0_TX (see BCK_REVA[1C], BCK_REVA[2C], BCK_REVA_2[1C], BCK_REVA_2[2C], BCK_REVA_2[3C], BCK_REVA_3[1C], BCK_REVA_3[2C], BCK_REVA_3[3C]), UART0_TX (see BCK_REVA[1C], BCK_REVA[3C], BCK_REVA_2[1C], BCK_REVA_2[2C], BCK_REVA_2[3C], BCK_REVA_3[1C], BCK_REVA_3[2C], BCK_REVA_3[3C]), UART0_TX (see BCK_REVA[2C], BCK_REVA[3C], BCK_REVA_2[1C], BCK_REVA_2[2C], BCK_REVA_2[3C], BCK_REVA_3[1C], BCK_REVA_3[2C], BCK_REVA_3[3C]), UART1_RX (see BCK_REVA[1C], BCK_REVA[2C], BCK_REVA_2[1C], BCK_REVA_2[2C], BCK_REVA_2[3C], BCK_REVA_3[1C], BCK_REVA_3[2C], BCK_REVA_3[3C]), UART1_RX (see BCK_REVA[1C], BCK_REVA[3C], BCK_REVA_2[1C], BCK_REVA_2[2C], BCK_REVA_2[3C], BCK_REVA_3[1C], BCK_REVA_3[2C], BCK_REVA_3[3C]), UART1_RX (see BCK_REVA[2C], BCK_REVA[3C], BCK_REVA_2[1C], BCK_REVA_2[2C], BCK_REVA_2[3C], BCK_REVA_3[1C], BCK_REVA_3[2C], BCK_REVA_3[3C]), UART1_TX (see BCK_REVA[1C], BCK_REVA[2C], BCK_REVA_2[1C], BCK_REVA_2[2C], BCK_REVA_2[3C], BCK_REVA_3[1C], BCK_REVA_3[2C], BCK_REVA_3[3C]), UART1_TX (see BCK_REVA[1C], BCK_REVA[3C], BCK_REVA_2[1C], BCK_REVA_2[2C], BCK_REVA_2[3C], BCK_REVA_3[1C], BCK_REVA_3[2C], BCK_REVA_3[3C]), UART1_TX (see BCK_REVA[2C], BCK_REVA[3C], BCK_REVA_2[1C], BCK_REVA_2[2C], BCK_REVA_2[3C], BCK_REVA_3[1C], BCK_REVA_3[2C], BCK_REVA_3[3C]), UART2_RX (see BCK_REVA[1C], BCK_REVA[2C], BCK_REVA_2[1C], BCK_REVA_2[2C], BCK_REVA_2[3C], BCK_REVA_3[1C], BCK_REVA_3[2C], BCK_REVA_3[3C]), UART2_RX (see BCK_REVA[1C], BCK_REVA[3C], BCK_REVA_2[1C], BCK_REVA_2[2C], BCK_REVA_2[3C], BCK_REVA_3[1C], BCK_REVA_3[2C], BCK_REVA_3[3C]), UART2_RX (see BCK_REVA[2C], BCK_REVA[3C], BCK_REVA_2[1C], BCK_REVA_2[2C], BCK_REVA_2[3C], BCK_REVA_3[1C], BCK_REVA_3[2C], BCK_REVA_3[3C]), UART2_TX (see BCK_REVA[1C], BCK_REVA[2C], BCK_REVA_2[1C], BCK_REVA_2[2C], BCK_REVA_2[3C], BCK_REVA_3[1C], BCK_REVA_3[2C], BCK_REVA_3[3C]), UART2_TX (see BCK_REVA[1C], BCK_REVA[3C], BCK_REVA_2[1C], BCK_REVA_2[2C], BCK_REVA_2[3C], BCK_REVA_3[1C], BCK_REVA_3[2C], BCK_REVA_3[3C]), UART2_TX (see BCK_REVA[2C], BCK_REVA[3C], BCK_REVA_2[1C], BCK_REVA_2[2C], BCK_REVA_2[3C], BCK_REVA_3[1C], BCK_REVA_3[2C], BCK_REVA_3[3C]), UART3_RX (see BCK_REVA[1B], BCK_REVA[2B], BCK_REVA_2[1B], BCK_REVA_2[2B], BCK_REVA_2[3B], BCK_REVA_3[1B], BCK_REVA_3[2B], BCK_REVA_3[3B]), UART3_RX (see BCK_REVA[1B], BCK_REVA[3B], BCK_REVA_2[1B], BCK_REVA_2[2B], BCK_REVA_2[3B], BCK_REVA_3[1B], BCK_REVA_3[2B], BCK_REVA_3[3B]), UART3_RX (see BCK_REVA[2B], BCK_REVA[3B], BCK_REVA_2[1B], BCK_REVA_2[2B], BCK_REVA_2[3B], BCK_REVA_3[1B], BCK_REVA_3[2B], BCK_REVA_3[3B]), UART3_TX (see BCK_REVA[1B], BCK_REVA[2B], BCK_REVA_2[1B], BCK_REVA_2[2B], BCK_REVA_2[3B], BCK_REVA_3[1B], BCK_REVA_3[2B], BCK_REVA_3[3B]), UART3_TX (see BCK_REVA[1B], BCK_REVA[3B], BCK_REVA_2[1B], BCK_REVA_2[2B], BCK_REVA_2[3B], BCK_REVA_3[1B], BCK_REVA_3[2B], BCK_REVA_3[3B]), UART3_TX (see BCK_REVA[2B], BCK_REVA[3B], BCK_REVA_2[1B], BCK_REVA_2[2B], BCK_REVA_2[3B], BCK_REVA_3[1B], BCK_REVA_3[2B], BCK_REVA_3[3B])

### Nets
GND: D1.1(K) D2.1(K) D3.1(K) J1.06 J1.17 J1.21 J1.24 J1.25 J1.32 J1.35 J1.39 J1.43 J1.45 J1.60 J1.63 J1.64 J1.67 J1.68 J1.71 J1.72 J1.77 J2.06 J2.17 J2.21 J2.24 J2.25 J2.32 J2.35 J2.39 J2.43 J2.45 J2.60 J2.63 J2.64 J2.67 J2.68 J2.71 J2.72 J2.77 J3.06 J3.17 J3.21 J3.24 J3.25 J3.32 J3.35 J3.39 J3.43 J3.45 J3.60 J3.63 J3.64 J3.67 J3.68 J3.71 J3.72 J3.77 ; port GND
+3.3V: J1.03 J1.04 J1.73 J1.74 J1.75 J1.76 J2.03 J2.04 J2.73 J2.74 J2.75 J2.76 J3.03 J3.04 J3.73 J3.74 J3.75 J3.76 ; port +3.3V
+5V: J1.01 J1.02 J2.01 J2.02 J3.01 J3.02 ; port +5V
A0: J1.22 J2.22 J3.22 ; port A0
A1: J1.20 J2.20 J3.20 ; port A1
A2: J1.18 J2.18 J3.18 ; port A2
A3: J1.16 J2.16 J3.16 ; port A3
A4: J1.14 J2.14 J3.14 ; port A4
A5: J1.12 J2.12 J3.12 ; port A5
A6: J1.10 J2.10 J3.10 ; port A6
A7: J1.08 J2.08 J3.08 ; port A7
A12: J1.31 J2.31 J3.31 ; port A12
A13: J1.33 J2.33 J3.33 ; port A13
DAC0: J1.41 J2.41 J3.41 ; port DAC0
DAC1: J1.37 J2.37 J3.37 ; port DAC1
GPIO0: J1.58 J2.58 J3.58 ; port GPIO0
GPIO1: J1.56 J2.56 J3.56 ; port GPIO1
GPIO2: J1.54 J2.54 J3.54 ; port GPIO2
GPIO3: J1.52 J2.52 J3.52 ; port GPIO3
GPIO4: J1.50 J2.50 J3.50 ; port GPIO4
GPIO5: J1.48 J2.48 J3.48 ; port GPIO5
GPIO6: J1.46 J2.46 J3.46 ; port GPIO6
GPIO7: J1.44 J2.44 J3.44 ; port GPIO7
GPIO8: J1.42 J2.42 J3.42 ; port GPIO8
GPIO9: J1.40 J2.40 J3.40 ; port GPIO9
GPIO10: J1.38 J2.38 J3.38 ; port GPIO10
GPIO11: J1.36 J2.36 J3.36 ; port GPIO11
GPIO12: J1.34 J2.34 J3.34 ; port GPIO12
GPIO13: J1.30 J2.30 J3.30 ; port GPIO13
GPIO14: J1.28 J2.28 J3.28 ; port GPIO14
GPIO15: J1.26 J2.26 J3.26 ; port GPIO15
GPIO22: J1.27 J2.27 J3.27 ; port GPIO22
GPIO23: J1.29 J2.29 J3.29 ; port GPIO23
I2C0_SCL: J1.69 J2.69 J3.69 ; port I2C0_SCL
I2C0_SDA: J1.65 J2.65 J3.65 ; port I2C0_SDA
I2C1_SCL: J1.23 J2.23 J3.23 ; port I2C1_SCL
I2C1_SDA: J1.19 J2.19 J3.19 ; port I2C1_SDA
PORT0: J1.15 J2.15 J3.15 ; port PORT0
PORT1: J1.13 J2.13 J3.13 ; port PORT1
PORT2: J1.11 J2.11 J3.11 ; port PORT2
PORT3: J1.09 J2.09 J3.09 ; port PORT3
PORT4: J1.07 J2.07 J3.07 ; port PORT4
PORT5: J1.05 J2.05 J3.05 ; port PORT5
SLOT1LED: J1.78 R1.1 ; port SLOT1LED
SLOT2LED: J2.78 R2.1 ; port SLOT2LED
SLOT3LED: J3.78 R3.1 ; port SLOT3LED
SPI_MISO: J1.62 J2.62 J3.62 ; port SPI_MISO
SPI_MOSI: J1.66 J2.66 J3.66 ; port SPI_MOSI
SPI_SCK: J1.70 J2.70 J3.70 ; port SPI_SCK
UART0_RX: J1.61 J2.61 J3.61 ; port UART0_RX
UART0_TX: J1.59 J2.59 J3.59 ; port UART0_TX
UART1_RX: J1.57 J2.57 J3.57 ; port UART1_RX
UART1_TX: J1.55 J2.55 J3.55 ; port UART1_TX
UART2_RX: J1.53 J2.53 J3.53 ; port UART2_RX
UART2_TX: J1.51 J2.51 J3.51 ; port UART2_TX
UART3_RX: J1.49 J2.49 J3.49 ; port UART3_RX
UART3_TX: J1.47 J2.47 J3.47 ; port UART3_TX
NetD1_2: D1.2(A) R1.2
NetD2_2: D2.2(A) R2.2
NetD3_2: D3.2(A) R3.2

### Library data of the parts
D1-D3 = KP_DELPS1.FP-QISI-34-U515-2-S: High Power LEDs - Single Color Pure Green TOPLED E1608; Manufacturer_Name: AMS OSRAM GROUP; Manufacturer_Part_Number: KP DELPS1.FP-QISI-34-U515-2-S; Geometry.Height: 0.7mm; Mouser Part Number: 720-KPDELPS1FPA0817; Mouser Price/Stock: https://www.mouser.co.uk/ProductDetail/ams-OSRAM/KP-DELPS1FP-QISI-34-U515-2-S?qs=CiayqK2gdcI39hBNO3GmaQ%3D%3D; Arrow Part Number: *; Arrow Price/Stock: *; Mouser Testing Part Number: *; Mouser Testing Price/Stock: *; Datasheet Link: https://www.dialog-semiconductor.com/sites/default/files/2021-09/DA14531_datasheet_3v4.pdf
J1-J3 = MECF-40-01-X-DV-WT: MECF .050" EDGE CARD ASSEMBLY; MF: Samtec; Price: None; MP: MECF-40-01-X-DV-WT; Value: *; Availability: Unavailable; Package: None
R1-R3 = CMP-2001-00608-1: Manufacturer: Panasonic; Part Number: ERA6AEB201V